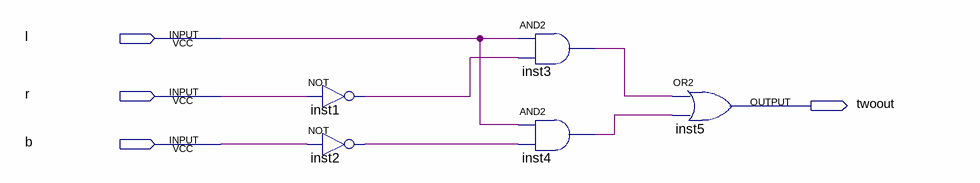
[diagram p0: schematic sheet]
// Quartus schematic a2.bdf as structural Verilog: 5 symbols, 4 pins
module a2 (
  input  l,
  input  r,
  input  b,
  output twoout
);

  wire inst1_out, inst2_out, inst3_out, inst4_out;

  not inst1 (inst1_out, r);
  not inst2 (inst2_out, b);
  and inst3 (inst3_out, l, inst1_out);
  and inst4 (inst4_out, l, inst2_out);
  or inst5 (twoout, inst3_out, inst4_out);
endmodule
